# Altium schematic sheet DGB.SchDoc
size A
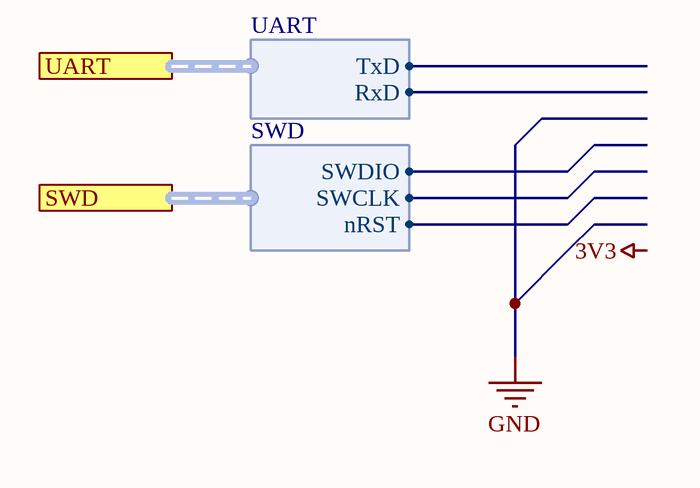
[diagram p0: DGB.SchDoc]

## Ports
SWD (harness SWD), UART (harness UART)

## Harnesses
SWD: SWDIO, SWCLK, nRST
UART: RxD, TxD

## Notes on the sheet
- Labels drawn without touching a wire or pin: 3V3